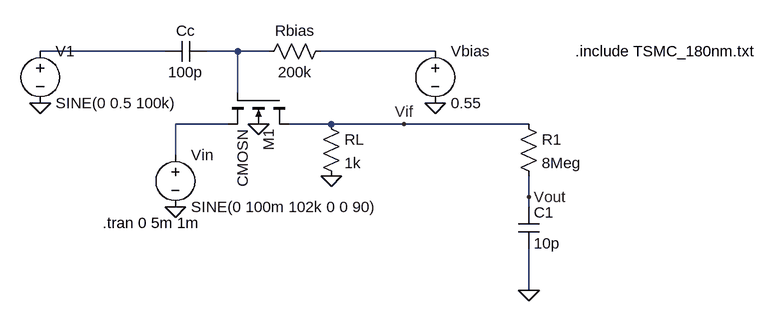
[diagram p0: schematic MIXER+LPF_AEC_PROJECT.asc]
MIXER+LPF_AEC_PROJECT.asc, the LTspice schematic file:
Version 4.1
SHEET 1 948 680
WIRE 16 0 -176 0
WIRE 128 0 80 0
WIRE 176 0 128 0
WIRE 432 0 256 0
WIRE 128 64 128 0
WIRE 112 112 32 112
WIRE 272 112 208 112
WIRE 384 112 272 112
WIRE 576 112 384 112
WIRE 32 160 32 112
WIRE 576 224 576 192
WIRE 576 240 576 224
WIRE 576 368 576 304
FLAG 160 112 0
FLAG 32 240 0
FLAG 272 192 0
FLAG 432 80 0
FLAG -176 80 0
FLAG 576 368 0
FLAG 576 224 Vout
FLAG 384 112 Vif
SYMBOL nmos4 208 64 R90
SYMATTR InstName M1
SYMATTR Value CMOSN
SYMATTR Value2 l=0.18u w=1.8u ad=0.81e-12 as=0.81e-12 pd=4.5u ps=4.5u
SYMBOL cap 80 -16 R90
WINDOW 0 0 32 VBottom 2
WINDOW 3 32 32 VTop 2
SYMATTR InstName Cc
SYMATTR Value 100p
SYMBOL voltage 32 144 R0
WINDOW 123 0 0 Left 0
WINDOW 39 0 0 Left 0
SYMATTR InstName Vin
SYMATTR Value SINE(0 100m 102k 0 0 90)
SYMBOL res 256 96 R0
SYMATTR InstName RL
SYMATTR Value 1k
SYMBOL res 272 -16 R90
WINDOW 0 0 56 VBottom 2
WINDOW 3 32 56 VTop 2
SYMATTR InstName Rbias
SYMATTR Value 200k
SYMBOL voltage 432 -16 R0
WINDOW 123 0 0 Left 0
WINDOW 39 0 0 Left 0
SYMATTR InstName Vbias
SYMATTR Value 0.55
SYMBOL voltage -176 -16 R0
WINDOW 123 0 0 Left 0
WINDOW 39 0 0 Left 0
SYMATTR InstName V1
SYMATTR Value SINE(0 0.5 100k)
SYMBOL res 560 96 R0
SYMATTR InstName R1
SYMATTR Value 8Meg
SYMBOL cap 560 240 R0
SYMATTR InstName C1
SYMATTR Value 10p
TEXT -80 264 Left 2 !.tran 0 5m 1m
TEXT 648 0 Left 2 !.include TSMC_180nm.txt

The netlist it stands for:
* MIXER+LPF_AEC_PROJECT.asc
M1 Vif N002 N004 0 CMOSN l=0.18u w=1.8u ad=0.81e-12 as=0.81e-12 pd=4.5u ps=4.5u
Cc N002 N001 100p
Vin N004 0 SINE(0 100m 102k 0 0 90)
RL Vif 0 1k
Rbias N003 N002 200k
Vbias N003 0 0.55
V1 N001 0 SINE(0 0.5 100k)
R1 Vif Vout 8Meg
C1 Vout 0 10p
.model NMOS NMOS
.model PMOS PMOS
.lib standard.mos
.tran 0 5m 1m
.include TSMC_180nm.txt
.backanno
.end